# Altium project LM-003.PrjPcb (part 4 of 4)
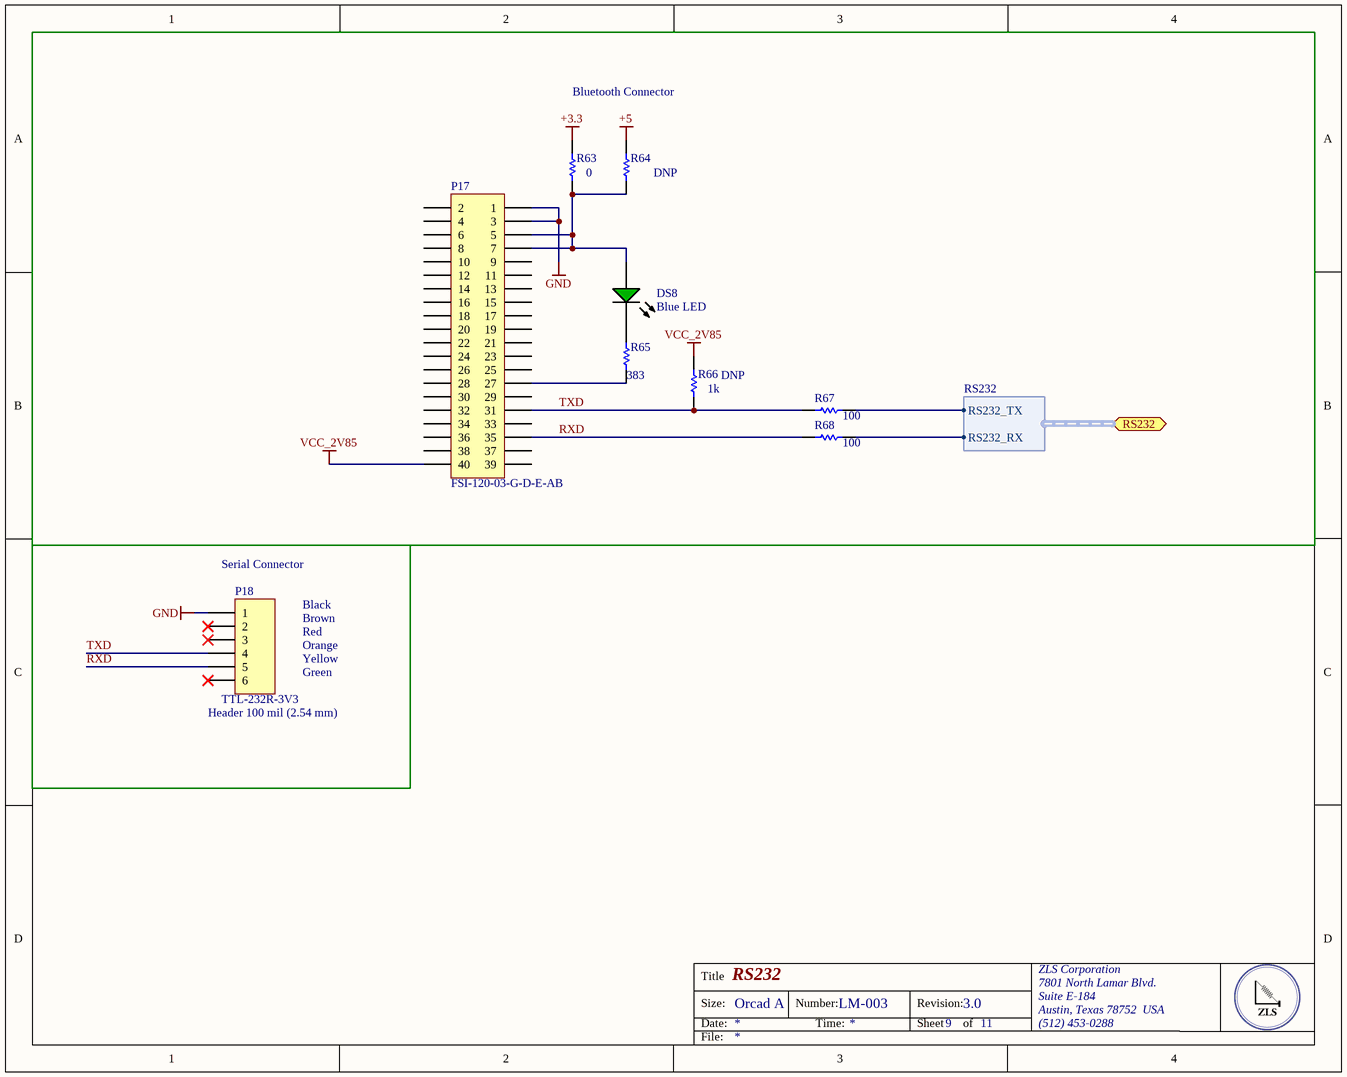
[diagram p9: RS232.SchDoc]

## Nets that join several sheets
+3.3: Power (R5.2), FeedbackLoop (5 pins), ADC (C34.1 C35.1 U15.17 U15.18), BBB Headers (U23#1.9-3 U23#1.9-4), Power Monitor (9 pins), Real Time Clock (C43.1 C44.1 U20.2), RS232 (R63.2)
+5: Power (9 pins), FeedbackLoop (13 pins), ADC (13 pins), BBB Headers (R31#2.2 R32.2), Connectors (P4.1 P5.7 P6.1 R36.2), heater_control (6 pins), Power Monitor (C42.2 R60.2 U19.5), RS232 (R64.2)
+5 BBB: Power (C14#1.2 R7.1 U4.7 U5.5), BBB Headers (U23#1.9-5 U23#1.9-6)
+12: Power (C15#1.2 U6#1.4), FeedbackLoop (5 pins), heater_control (10 pins), Power Monitor (R59.2)
-5: Power (C9.1 U3.6), FeedbackLoop (C17.2 C24.1 U7.2 U9.5), ADC (U13#2.2 U13#2.3 U14#2.2 U27.2), Connectors (P5.5), Power Monitor (U19.2)
AGND: Power (R8.2), ADC (14 pins), Connectors (P7.2), heater_control (P16.3), Power Monitor (14 pins)
Batt+: Power (K1.4 P1.1), Power Monitor (R56.2)
GND: Power (25 pins), FeedbackLoop (32 pins), ADC (C34.2 C35.2 U15.15 U15.16), BBB Headers (8 pins), Connectors (5 pins), heater_control (12 pins), Real Time Clock (BT1.2 C43.2 C44.2 U20.5), RS232 (P17.1 P17.3 P18.1)
ZH: Power (5 pins), FeedbackLoop (C21.1 U8.8), Connectors (P5.10), Power Monitor (R53.2)
ZP: FeedbackLoop (C20.1 U8.1), ADC (R31#1.2), Connectors (P5.6)
9-33: BBB Headers (U23#1.9-33), Power Monitor (U18.1 U18.4)
9-35: BBB Headers (U23#1.9-35), Power Monitor (U22.1 U22.4)
9-37: BBB Headers (U23#1.9-37), Power Monitor (U23#2.1 U23#2.4)
9-38: BBB Headers (U23#1.9-38), Power Monitor (U24.1 U24.4)
9-39: BBB Headers (U23#1.9-39), Power Monitor (U17.1 U17.4)
BEAM: FeedbackLoop (U9.4), Connectors (P5.3)
CH0: FeedbackLoop (C18.1 R10.1 R12.1), ADC (U15.2)
I2C2_SCL: BBB Headers (R32.1 U23#1.9-19), Connectors (P6.3), Real Time Clock (U20.8)
I2C2_SDA: BBB Headers (R31#2.1 U23#1.9-20), Connectors (P6.2), Real Time Clock (U20.7)
IC_Thermistor: BBB Headers (U23#1.9-36), Power Monitor (U19.1 U19.4)
Lid Thermistor: Connectors (P7.1 R36.1), Power Monitor (R55.2)
NetP2_2: Power (P2.2), BBB Headers (U23#1.9-9)
NetP5_2: FeedbackLoop (U11.1 U11.4), Connectors (P5.2)
NetP5_4: FeedbackLoop (U10.1 U10.4), Connectors (P5.4)
NetP5_12: FeedbackLoop (U6#2.1 U6#2.4), Connectors (P5.12)
NetP12_3: ADC (U30.3), heater_control (P12.3 R39.1)
NetP12_4: ADC (U29.3), heater_control (P12.4 R38.2)
NetP14_4: ADC (U28.3), heater_control (P14.4 R40.1)
NetP15_4: ADC (U27.3), heater_control (P15.4 R44.2)
NetP16_4: heater_control (P16.4 R50.2), Power Monitor (U19.3)
NetP19_4: ADC (U26.3), heater_control (P19.4 R47.1)
NetR42_1: BBB Headers (U23#1.8-3), heater_control (R42.1)
NetR43_1: BBB Headers (U23#1.8-6), heater_control (R43.1)
NetR46_1: BBB Headers (U23#1.8-5), heater_control (R46.1)
NetR49_1: BBB Headers (U23#1.8-4), heater_control (R49.1)
NetR52_1: BBB Headers (U23#1.8-14), heater_control (R52.1)
NetU5_3: Power (U5.3), BBB Headers (U23#1.8-22)
NetU6#2_3: FeedbackLoop (U6#2.3), BBB Headers (U23#1.9-14)
NetU12_3: FeedbackLoop (U12.3), BBB Headers (U23#1.8-19)
NetU14#1_3: FeedbackLoop (U14#1.3), BBB Headers (U23#1.8-13)
NetU15_12: ADC (U15.12), BBB Headers (U23#1.8-7)
NetU21_1: BBB Headers (U23#1.9-40), Power Monitor (U21.1 U21.4)
Serial5_RX: BBB Headers (U23#1.8-38), RS232 (R68.1)
Serial5_TX: BBB Headers (U23#1.8-37), RS232 (R67.1)
SPI0_CS0: ADC (U15.10), BBB Headers (U23#1.9-17)
SPI0_MISO: ADC (U15.14), BBB Headers (U23#1.9-21)
SPI0_MOSI: ADC (U15.11), BBB Headers (U23#1.9-18)
SPI0_SCLK: ADC (U15.13), BBB Headers (U23#1.9-22)
SPI1_CS0: BBB Headers (U23#1.9-28), Connectors (P4.7)
SPI1_MISO: BBB Headers (U23#1.9-29), Connectors (P4.4)
SPI1_MOSI: BBB Headers (U23#1.9-30), Connectors (P4.5)
SPI1_SCLK: BBB Headers (U23#1.9-31), Connectors (P4.6)